# Altium project Single_Hand_YK.PrjPcb
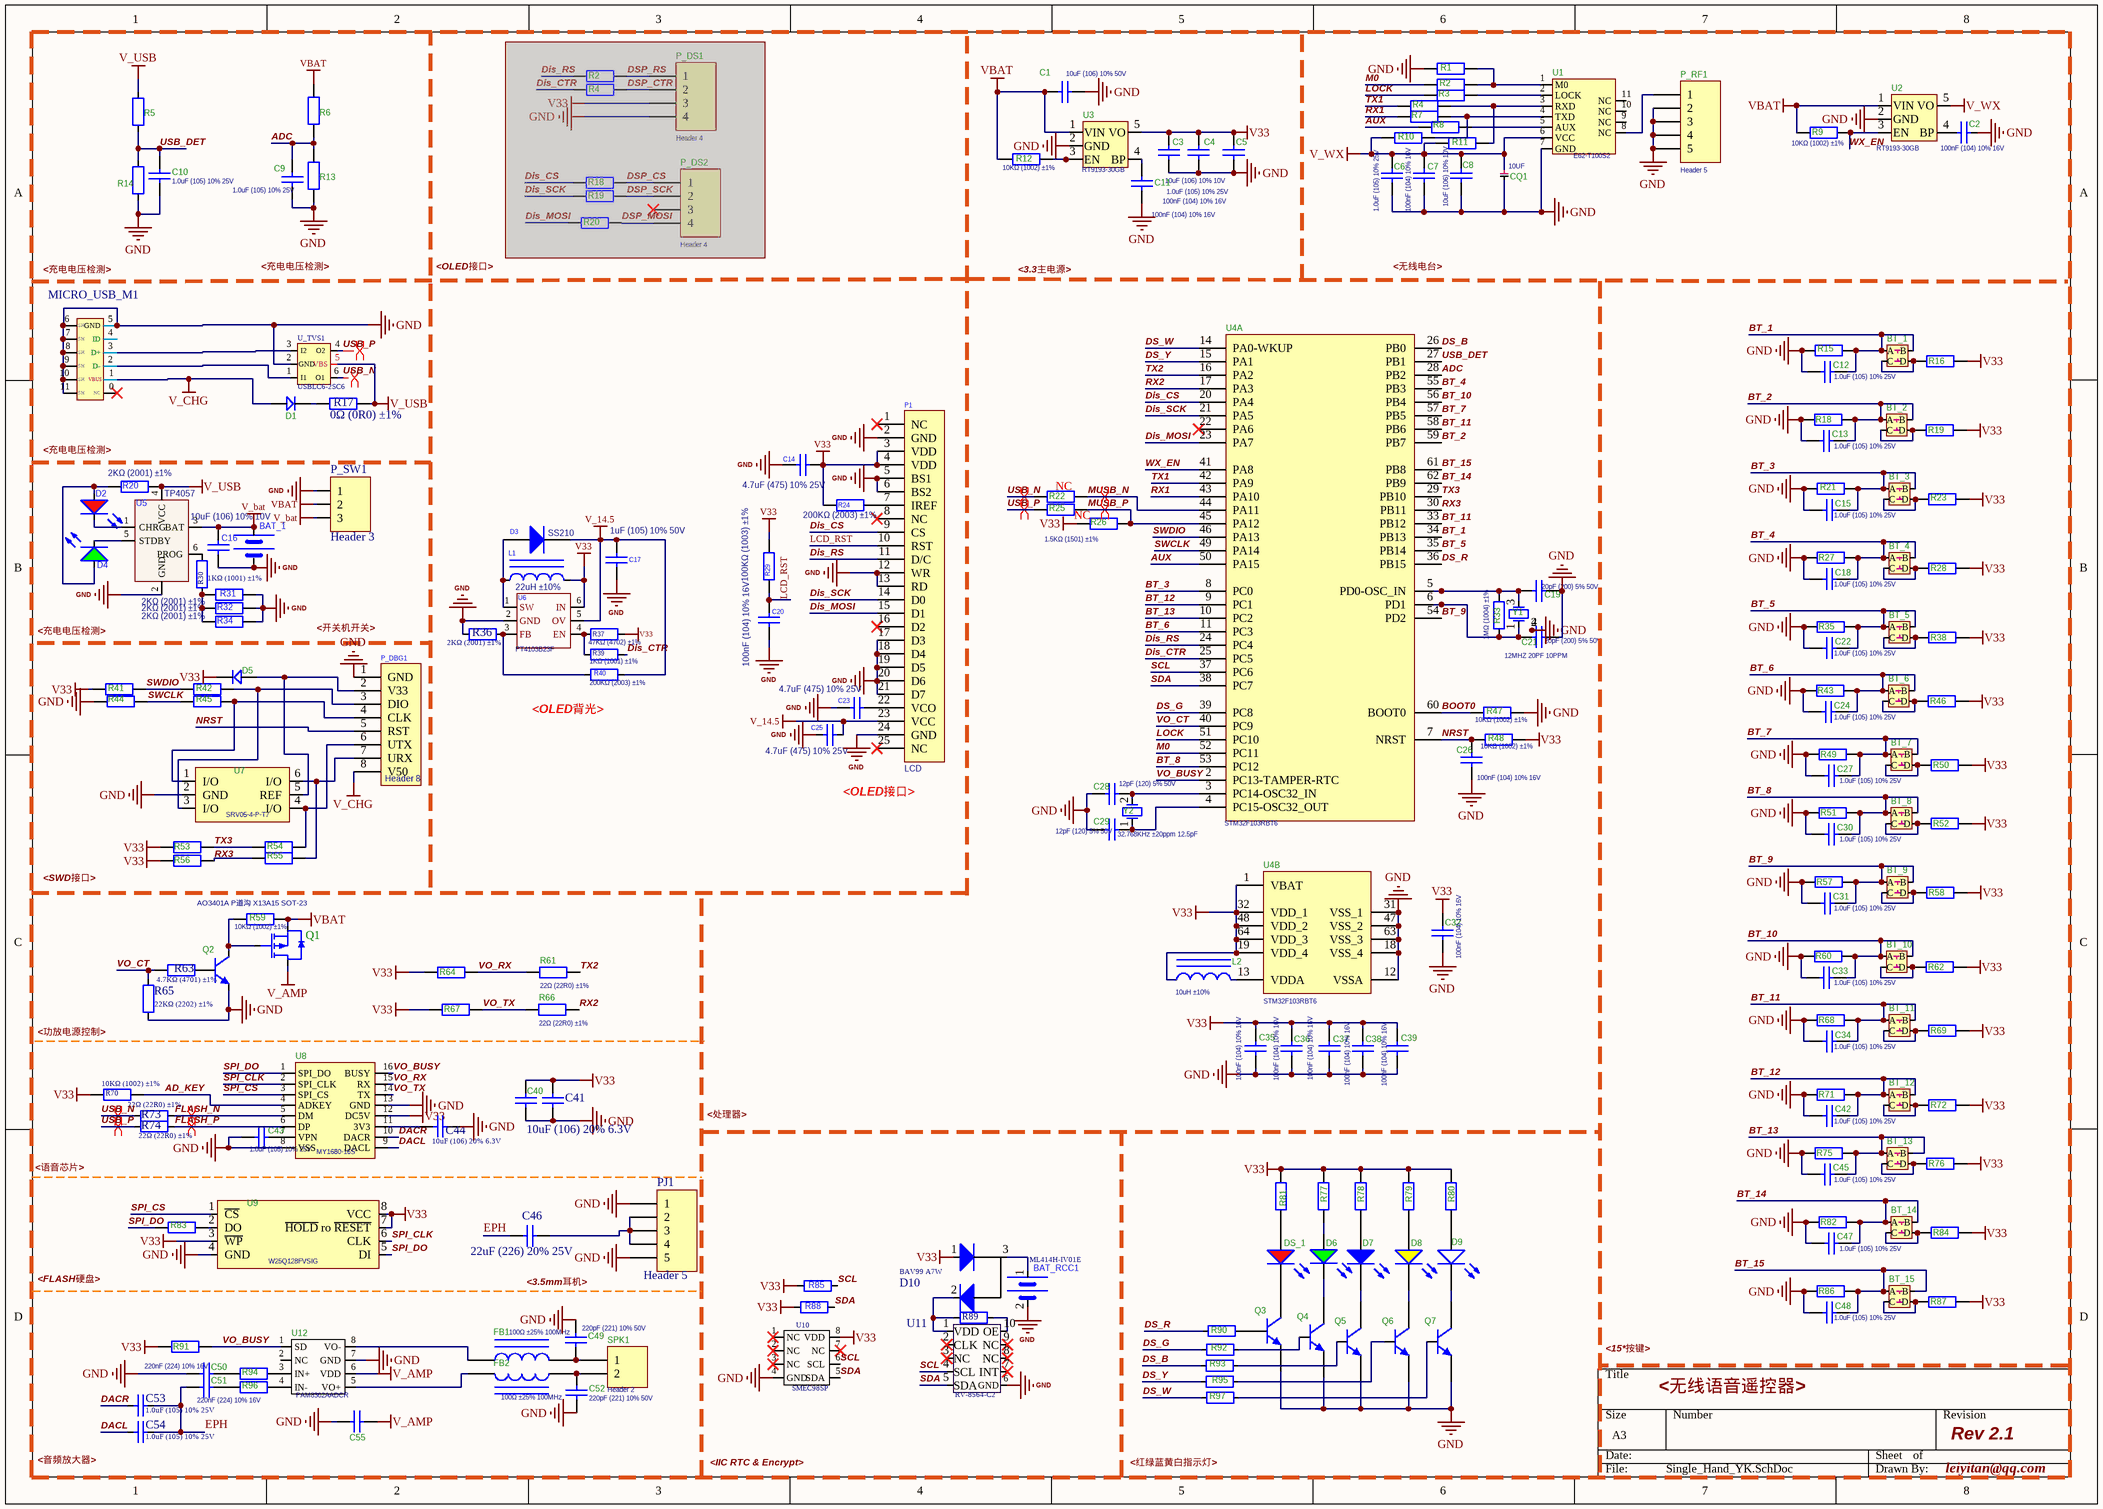
[diagram p0: Single_Hand_YK.SchDoc]
1 sheet, 221 parts. Net scope: global (net labels, ports and power ports of the same name join across sheets).
Board file: Single_Hand_YK.PcbDoc

## Sheet Single_Hand_YK.SchDoc
size A3

### Parts
(Parts that share a designator on the sheet are numbered #1, #2 ... from top to bottom, then left to right.)
BAT_1  CR1120  [HDR1X2]  (value not drawn)
BAT_RCC1  ML414H-IV01E  [ML414H IV01E]
BT_1  BUT_12*12*7.3  [SW-1212]  (value not drawn)
BT_2  BUT_12*12*7.3  [SW-1212]  (value not drawn)
BT_3  BUT_12*12*7.3  [SW-1212]  (value not drawn)
BT_4  BUT_12*12*7.3  [SW-1212]  (value not drawn)
BT_5  BUT_12*12*7.3  [SW-1212]  (value not drawn)
BT_6  BUT_12*12*7.3  [SW-1212]  (value not drawn)
BT_7  BUT_12*12*7.3  [SW-1212]  (value not drawn)
BT_8  BUT_12*12*7.3  [SW-1212]  (value not drawn)
BT_9  BUT_12*12*7.3  [SW-1212]  (value not drawn)
BT_10  BUT_12*12*7.3  [SW-1212]  (value not drawn)
BT_11  BUT_12*12*7.3  [SW-1212]  (value not drawn)
BT_12  BUT_12*12*7.3  [SW-1212]  (value not drawn)
BT_13  BUT_12*12*7.3  [SW-1212]  (value not drawn)
BT_14  BUT_12*12*7.3  [SW-1212]  (value not drawn)
BT_15  BUT_12*12*7.3  [SW-1212]  (value not drawn)
C1  10uF (106) 10% 50V  [1206_C]
C2  100nF (104) 10% 16V  [0402_C]
C3  10uF (106) 10% 10V  [0603_C]
C4  1.0uF (105) 10% 25V  [0402_C]
C5  100nF (104) 10% 16V  [0402_C]
C6  1.0uF (105) 10% 25V  [0402_C]
C7  100nF (104) 10% 16V  [0402_C]
C8  10uF (106) 10% 10V  [0603_C]
C9  1.0uF (105) 10% 25V  [0402_C]
C10  1.0uF (105) 10% 25V  [0402_C]
C11  100nF (104) 10% 16V  [0402_C]
C12  1.0uF (105) 10% 25V  [0402_C]
C13  1.0uF (105) 10% 25V  [0402_C]
C14  4.7uF (475) 10% 25V  [0805_C]
C15  1.0uF (105) 10% 25V  [0402_C]
C16  10uF (106) 10% 10V  [0603_C]
C17  1uF (105) 10% 50V  [0603_C]
C18  1.0uF (105) 10% 25V  [0402_C]
C19  20pF (200) 5% 50V  [0402_C]
C20  100nF (104) 10% 16V  [0402_C]
C21  20pF (200) 5% 50V  [0402_C]
C22  1.0uF (105) 10% 25V  [0402_C]
C23  4.7uF (475) 10% 25V  [0805_C]
C24  1.0uF (105) 10% 25V  [0402_C]
C25  4.7uF (475) 10% 25V  [0805_C]
C26  100nF (104) 10% 16V  [0402_C]
C27  1.0uF (105) 10% 25V  [0402_C]
C28  12pF (120) 5% 50V  [0402_C]
C29  12pF (120) 5% 50V  [0402_C]
C30  1.0uF (105) 10% 25V  [0402_C]
C31  1.0uF (105) 10% 25V  [0402_C]
C32  100nF (104) 10% 16V  [0402_C]
C33  1.0uF (105) 10% 25V  [0402_C]
C34  1.0uF (105) 10% 25V  [0402_C]
C35  100nF (104) 10% 16V  [0402_C]
C36  100nF (104) 10% 16V  [0402_C]
C37  100nF (104) 10% 16V  [0402_C]
C38  100nF (104) 10% 16V  [0402_C]
C39  100nF (104) 10% 16V  [0402_C]
C40  100nF (104) 10% 16V  [0402_C]  (value not drawn)
C41  10uF (106) 20% 6.3V  [0402_C]
C42  1.0uF (105) 10% 25V  [0402_C]
C43  1.0uF (105) 10% 25V  [0402_C]
C44  10uF (106) 20% 6.3V  [0402_C]
C45  1.0uF (105) 10% 25V  [0402_C]
C46  22uF (226) 20% 25V  [0805_C]
C47  1.0uF (105) 10% 25V  [0402_C]
C48  1.0uF (105) 10% 25V  [0402_C]
C49  220pF (221) 10% 50V  [0402_C]
C50  220nF (224) 10% 16V  [0402_C]
C51  220nF (224) 10% 16V  [0402_C]
C52  220pF (221) 10% 50V  [0402_C]
C53  1.0uF (105) 10% 25V  [0402_C]
C54  1.0uF (105) 10% 25V  [0402_C]
C55  10uF (106) 10% 25V  [0805_C]  (value not drawn)
CQ1  10UF  [C1210]
D1  RB160M-60/1A  [M-FLAT]  (value not drawn)
D2  (no value)  [0603_LED_S1]
D3  SS210  [SMA(DO-214AC)_S1]
D4  (no value)  [0603_LED_S1]
D5  CMS01  [M-FLAT]  (value not drawn)
D6  绿灯 0603  [LED-5MM]  (value not drawn)  (no BOM)
D7  蓝灯 0603  [LED-5MM]  (value not drawn)  (no BOM)
D8  黄灯 0603  [LED-5MM]  (value not drawn)  (no BOM)
D9  白灯 0603  [LED-5MM]  (value not drawn)  (no BOM)
D10  BAV99 A7W  [SOT-23(SOT-23-3)]
DS_1  红灯 0603  [LED-5MM]  (value not drawn)  (no BOM)
FB1  100Ω ±25% 100MHz  [0805_L]
FB2  100Ω ±25% 100MHz  [0805_L]
L1  22uH ±10%  [0805_L]
L2  10uH ±10%  [0603_L]
MICRO_USB_M1  沉板MICRO_USB  [MICRO_USB]  (value not drawn)
P1  LCD  [TOEL9M0038]
P_DBG1  Header 8  [MHDR1X8]
P_DS1  Header 4  [MHDR1X4]  (masked out: inside a compile mask, not in the netlist)
P_DS2  Header 4  [MHDR1X4]  (masked out: inside a compile mask, not in the netlist)
P_RF1  Header 5  [SMA-2]
P_SW1  Header 3  [HDR1X3]
PJ1  Header 5  [PJK-381A]
Q1  AO3401A P道沟 X13A15 SOT-23  [SOT-23-3L]
Q2  MMBT5551  G1  [SOT-23(SOT-23-3)]  (value not drawn)
Q3  MMBT5551  G1  [SOT-23(SOT-23-3)]  (value not drawn)
Q4  MMBT5551  G1  [SOT-23(SOT-23-3)]  (value not drawn)
Q5  MMBT5551  G1  [SOT-23(SOT-23-3)]  (value not drawn)
Q6  MMBT5551  G1  [SOT-23(SOT-23-3)]  (value not drawn)
Q7  MMBT5551  G1  [SOT-23(SOT-23-3)]  (value not drawn)
R1  10KΩ (1002) ±1%  [0402_R]  (value not drawn)
R2#1  10Ω (10R0) ±1%  [0402_R]  (value not drawn)  (masked out: inside a compile mask, not in the netlist)
R2#2  22Ω (22R0) ±1%  [0402_R]  (value not drawn)
R3  22Ω (22R0) ±1%  [0402_R]  (value not drawn)
R4#1  10Ω (10R0) ±1%  [0402_R]  (value not drawn)  (masked out: inside a compile mask, not in the netlist)
R4#2  22Ω (22R0) ±1%  [0402_R]  (value not drawn)
R5  100KΩ (1003) ±1%  [0402_R]  (value not drawn)
R6  100KΩ (1003) ±1%  [0402_R]  (value not drawn)
R7  22Ω (22R0) ±1%  [0402_R]  (value not drawn)
R8  22Ω (22R0) ±1%  [0402_R]  (value not drawn)
R9  10KΩ (1002) ±1%  [0402_R]
R10  10KΩ (1002) ±1%  [0402_R]  (value not drawn)
R11  10KΩ (1002) ±1%  [0402_R]  (value not drawn)
R12  10KΩ (1002) ±1%  [0402_R]
R13  100KΩ (1003) ±1%  [0402_R]  (value not drawn)
R14  100KΩ (1003) ±1%  [0402_R]  (value not drawn)
R15  100KΩ (1003) ±1%  [0402_R]  (value not drawn)
R16  10KΩ (1002) ±1%  [0402_R]  (value not drawn)
R17  0Ω (0R0) ±1%  [0603_R]
R18#1  10Ω (10R0) ±1%  [0402_R]  (value not drawn)  (masked out: inside a compile mask, not in the netlist)
R18#2  100KΩ (1003) ±1%  [0402_R]  (value not drawn)
R19#1  10Ω (10R0) ±1%  [0402_R]  (value not drawn)  (masked out: inside a compile mask, not in the netlist)
R19#2  10KΩ (1002) ±1%  [0402_R]  (value not drawn)
R20#1  10Ω (10R0) ±1%  [0402_R]  (value not drawn)  (masked out: inside a compile mask, not in the netlist)
R20#2  2KΩ (2001) ±1%  [0402_R]
R21  100KΩ (1003) ±1%  [0402_R]  (value not drawn)
R22  22Ω (22R0) ±1%  [0402_R]  (value not drawn)  (no BOM)
R23  10KΩ (1002) ±1%  [0402_R]  (value not drawn)
R24  200KΩ (2003) ±1%  [0402_R]
R25  22Ω (22R0) ±1%  [0402_R]  (value not drawn)  (no BOM)
R26  1.5KΩ (1501) ±1%  [0402_R]
R27  100KΩ (1003) ±1%  [0402_R]  (value not drawn)
R28  10KΩ (1002) ±1%  [0402_R]  (value not drawn)
R29  100KΩ (1003) ±1%  [0402_R]
R30  1KΩ (1001) ±1%  [0402_R]
R31  2KΩ (2001) ±1%  [0402_R]
R32  2KΩ (2001) ±1%  [0402_R]
R33  1MΩ (1004) ±1%  [0402_R]
R34  2KΩ (2001) ±1%  [0402_R]
R35  100KΩ (1003) ±1%  [0402_R]  (value not drawn)
R36  2KΩ (2001) ±1%  [0402_R]
R37  47KΩ (4702) ±1%  [0402_R]
R38  10KΩ (1002) ±1%  [0402_R]  (value not drawn)
R39  1KΩ (1001) ±1%  [0402_R]
R40  200KΩ (2003) ±1%  [0402_R]
R41  10KΩ (1002) ±1%  [0402_R]  (value not drawn)
R42  10Ω (10R0) ±1%  [0402_R]  (value not drawn)
R43  100KΩ (1003) ±1%  [0402_R]  (value not drawn)
R44  10KΩ (1002) ±1%  [0402_R]  (value not drawn)
R45  10Ω (10R0) ±1%  [0402_R]  (value not drawn)
R46  10KΩ (1002) ±1%  [0402_R]  (value not drawn)
R47  10KΩ (1002) ±1%  [0402_R]
R48  10KΩ (1002) ±1%  [0402_R]
R49  100KΩ (1003) ±1%  [0402_R]  (value not drawn)
R50  10KΩ (1002) ±1%  [0402_R]  (value not drawn)
R51  100KΩ (1003) ±1%  [0402_R]  (value not drawn)
R52  10KΩ (1002) ±1%  [0402_R]  (value not drawn)
R53  10KΩ (1002) ±1%  [0402_R]  (value not drawn)
R54  22Ω (22R0) ±1%  [0402_R]  (value not drawn)
R55  22Ω (22R0) ±1%  [0402_R]  (value not drawn)
R56  10KΩ (1002) ±1%  [0402_R]  (value not drawn)
R57  100KΩ (1003) ±1%  [0402_R]  (value not drawn)
R58  10KΩ (1002) ±1%  [0402_R]  (value not drawn)
R59  10KΩ (1002) ±1%  [0402_R]
R60  100KΩ (1003) ±1%  [0402_R]  (value not drawn)
R61  22Ω (22R0) ±1%  [0402_R]
R62  10KΩ (1002) ±1%  [0402_R]  (value not drawn)
R63  4.7KΩ (4701) ±1%  [0402_R]
R64  10KΩ (1002) ±1%  [0402_R]  (value not drawn)
R65  22KΩ (2202) ±1%  [0402_R]
R66  22Ω (22R0) ±1%  [0402_R]
R67  10KΩ (1002) ±1%  [0402_R]  (value not drawn)
R68  100KΩ (1003) ±1%  [0402_R]  (value not drawn)
R69  10KΩ (1002) ±1%  [0402_R]  (value not drawn)
R70  10KΩ (1002) ±1%  [0402_R]
R71  100KΩ (1003) ±1%  [0402_R]  (value not drawn)
R72  10KΩ (1002) ±1%  [0402_R]  (value not drawn)
R73  22Ω (22R0) ±1%  [0402_R]
R74  22Ω (22R0) ±1%  [0402_R]
R75  100KΩ (1003) ±1%  [0402_R]  (value not drawn)
R76  10KΩ (1002) ±1%  [0402_R]  (value not drawn)
R77  1KΩ (1001) ±1%  [0402_R]  (value not drawn)
R78  1KΩ (1001) ±1%  [0402_R]  (value not drawn)
R79  1KΩ (1001) ±1%  [0402_R]  (value not drawn)
R80  1KΩ (1001) ±1%  [0402_R]  (value not drawn)
R81  1KΩ (1001) ±1%  [0402_R]  (value not drawn)
R82  100KΩ (1003) ±1%  [0402_R]  (value not drawn)
R83  100Ω (1000) ±1%  [0402_R]  (value not drawn)
R84  10KΩ (1002) ±1%  [0402_R]  (value not drawn)
R85  10KΩ (1002) ±1%  [0402_R]  (value not drawn)
R86  100KΩ (1003) ±1%  [0402_R]  (value not drawn)
R87  10KΩ (1002) ±1%  [0402_R]  (value not drawn)
R88  10KΩ (1002) ±1%  [0402_R]  (value not drawn)
R89  100KΩ (1003) ±1%  [0402_R]  (value not drawn)
R90  10KΩ (1002) ±1%  [0402_R]  (value not drawn)
R91  10KΩ (1002) ±1%  [0402_R]  (value not drawn)
R92  10KΩ (1002) ±1%  [0402_R]  (value not drawn)
R93  10KΩ (1002) ±1%  [0402_R]  (value not drawn)
R94  10KΩ (1002) ±1%  [0402_R]  (value not drawn)
R95  10KΩ (1002) ±1%  [0402_R]  (value not drawn)
R96  10KΩ (1002) ±1%  [0402_R]  (value not drawn)
R97  10KΩ (1002) ±1%  [0402_R]  (value not drawn)
SPK1  Header 2  [HDR1X2]
U1  E62-T100S2  [E62-T100S2]
U2  RT9193-30GB  [SOT-23-5]
U3  RT9193-30GB  [SOT-23-5]
U4  STM32F103RBT6  [LQFP-64_10x10x05P]  (parts A,B of 2)
U5  TP4057  [SOT-23-6]
U6  PT4103B23F  [SOT23-6]
U7  SRV05-4-P-T7  [SOT-23-6]
U8  MY1680-16S  [SOIC-16_150mil]
U9  W25Q128FVSIG  [SOIC-8_208mil]
U10  SMEC98SP  [SOP8]
U11  RV-8564-C2  [RV-8564-C2]
U12  PAM8302AADCR  [SOIC-8_150mil]
U_TVS1  USBLC6-2SC6  [SOT-23-6]
Y1  12MHZ 20PF 10PPM  [SMD-3225_4P]
Y2  32.768KHz ±20ppm 12.5pF  [SMD-3215_2P FC - 135]

### Nets
GND: BAT_1.2(GND) BAT_RCC1.2(GND) C1.2 C2.2 C3.1 C4.1 C5.1 C6.1 C7.1 C8.1 C9.2 C10.2 C11.2 C12.1 C13.1 C14.2 C15.1 C16.1 C17.1 C18.1 C19.2 C20.1 C21.2 C22.1 C23.2 C24.1 C25.2 C26.1 C27.1 C28.1 C29.1 C30.1 C31.1 C32.1 C33.1 C34.1 C35.1 C36.1 C37.1 C38.1 C39.1 C40.1 C41.1 C42.1 C43.1 C44.2 C45.1 C47.1 C48.1 C49.1 C50.1 C52.1 C55.1 CQ1.2 MICRO_USB_M1.5(GND) MICRO_USB_M1.6(SH) MICRO_USB_M1.7(SH) MICRO_USB_M1.8(SH) MICRO_USB_M1.9(SH) MICRO_USB_M1.10(SH) MICRO_USB_M1.11(SH) P1.2(GND) P1.5(BS1) P1.6(BS2) P1.12(WR) P1.13(RD) P1.17(D3) P1.18(D4) P1.19(D5) P1.20(D6) P1.21(D7) P1.24(GND) P_DBG1.1(GND) P_RF1.2 P_RF1.3 P_SW1.1 PJ1.1 PJ1.5 Q2.2(E) Q3.2(E) Q4.2(E) Q5.2(E) Q6.1(B) Q6.2(E) Q7.2(E) R1.2 R13.2 R14.2 R15.1 R18#2.1 R21.1 R27.1 R31.2 R32.2 R34.2 R35.1 R36.1 R43.1 R44.1 R47.2 R49.1 R51.1 R57.1 R60.1 R65.1 R68.1 R71.1 R75.1 R82.1 R86.1 R95.1 U1.7(GND) U2.2(GND) U3.2(GND) U4.12(VSSA) U4.18(VSS_4) U4.31(VSS_1) U4.47(VSS_2) U4.63(VSS_3) U5.2(GND) U6.2(GND) U7.2(GND) U8.8(VSS) U8.13(GND) U9.4(GND) U10.4(GND) U11.6(GND) U12.7(GND) U_TVS1.2(GND) Y1.2(GND) Y1.4(GND)
V33: C3.2 C4.2 C5.2 C14.1 C32.2 C35.2 C36.2 C37.2 C38.2 C39.2 C40.2 C41.2 D5.2 D10.1(A) L1.2 L2.1 P1.3(VDD) P1.4(VDD) R16.2 R19#2.2 R23.2 R24.1 R26.1 R28.2 R29.2 R37.2 R38.2 R41.1 R46.2 R48.2 R50.2 R52.2 R53.1 R56.1 R58.2 R62.2 R64.1 R67.1 R69.2 R70.1 R72.2 R76.2 R77.2 R78.2 R79.2 R80.2 R81.2 R84.2 R85.1 R87.2 R88.1 R91.1 U3.5(VO) U4.1(VBAT) U4.19(VDD_4) U4.32(VDD_1) U4.48(VDD_2) U4.64(VDD_3) U6.6(IN) U8.12(DC5V) U9.3(~{WP}) U9.7(~{HOLD}_ro_~{RESET}) U9.8(VCC) U10.8(VDD)
V_14.5: C17.2 C25.1 D3.2(K) P1.23(VCC) R40.1 U6.5(OV)
V_AMP: C55.2 Q1.3(D) U12.6(VDD)
V_bat: BAT_1.1(VCC) C16.2 P_SW1.3 U5.3(BAT)
V_CHG: D1.1 MICRO_USB_M1.1(VBUS) P_DBG1.8(V50)
V_USB: R5.1 R17.2 R20#2.2 U5.4(VCC) U_TVS1.5(VBS)
V_WX: C6.2 C7.2 C8.2 CQ1.1 R10.1 R11.1 U1.6(VCC) U2.5(VO)
VBAT: C1.1 P_SW1.2 Q1.2(S) R6.1 R9.2 R12.1 R59.2 U2.1(VIN) U3.1(VIN)
AD_KEY: R70.2 U8.4(ADKEY)
ADC: C9.1 R6.2 R13.1 U4.28(PB2)
AUX: R8.1 U4.50(PA15)
BOOT0: R47.1 U4.60(BOOT0)
BT_1: BT_1.1(A) C12.2 R15.2 U4.34(PB13)
BT_2: BT_2.1(A) C13.2 R18#2.2 U4.59(PB7)
BT_3: BT_3.1(A) C15.2 R21.2 U4.8(PC0)
BT_4: BT_4.1(A) C18.2 R27.2 U4.55(PB3)
BT_5: BT_5.1(A) C22.2 R35.2 U4.35(PB14)
BT_6: BT_6.1(A) C24.2 R43.2 U4.11(PC3)
BT_7: BT_7.1(A) C27.2 R49.2 U4.57(PB5)
BT_8: BT_8.1(A) C30.2 R51.2 U4.53(PC12)
BT_9: BT_9.1(A) C31.2 R57.2 U4.54(PD2)
BT_10: BT_10.1(A) C33.2 R60.2 U4.56(PB4)
BT_11: BT_11.1(A) C34.2 R68.2 U4.33(PB12) U4.58(PB6)
BT_12: BT_12.1(A) C42.2 R71.2 U4.9(PC1)
BT_13: BT_13.1(A) C45.2 R75.2 U4.10(PC2)
BT_14: BT_14.1(A) C47.2 R82.2 U4.62(PB9)
BT_15: BT_15.1(A) C48.2 R86.2 U4.61(PB8)
DACL: C54.1 U8.9(DACL)
DACR: C53.1 U8.10(DACR)
Dis_CS: P1.9(CS) U4.20(PA4)
Dis_CTR: R39.2 U4.25(PC5)
Dis_MOSI: P1.15(D1) U4.23(PA7)
Dis_RS: P1.11(D/C) U4.24(PC4)
Dis_SCK: P1.14(D0) U4.21(PA5)
DS_B: R93.2 U4.26(PB0)
DS_G: R92.2 U4.39(PC8)
DS_R: R90.2 U4.36(PB15)
DS_W: R97.2 U4.14(PA0-WKUP)
DS_Y: R95.2 U4.15(PA1)
EPH: C46.1 C51.2 C53.2 C54.2
FLASH_N: R73.2 U8.5(DM)
FLASH_P: R74.2 U8.6(DP)
LCD_RST: C20.2 P1.10(RST) R29.1
LOCK: R3.1 U4.51(PC10)
M0: R2#2.1 U4.52(PC11)
MUSB_N: R22.1 U4.44(PA11)
MUSB_P: R25.1 R26.2 U4.45(PA12)
NRST: C26.2 P_DBG1.5(RST) R48.1 U4.7(NRST)
RX1: R7.1 U4.43(PA10)
RX2: R66.2 U4.17(PA3)
RX3: R55.1 R56.2 U4.30(PB11)
SCL: R85.2 U4.37(PC6) U10.6(SCL) U11.4(SCL)
SDA: R88.2 U4.38(PC7) U10.5(SDA) U11.5(SDA)
SPI_CLK: U8.2(SPI_CLK) U9.6(CLK)
SPI_CS: U8.3(SPI_CS) U9.1(~{CS})
SPI_DO: R83.1 U8.1(SPI_DO) U9.5(DI)
SWCLK: R44.2 R45.1 U4.49(PA14)
SWDIO: R41.2 R42.1 U4.46(PA13)
TX1: R4#2.1 U4.42(PA9)
TX2: R61.2 U4.16(PA2)
TX3: R53.2 R54.1 U4.29(PB10)
USB_DET: C10.1 R5.2 R14.1 U4.27(PB1)
USB_N: R22.2 R73.1 U_TVS1.6(O1)
USB_P: R25.2 R74.1 U_TVS1.4(O2)
VO_BUSY: R91.2 U4.2(PC13-TAMPER-RTC) U8.16(BUSY) U12.1(SD)
VO_CT: R63.1 R65.2 U4.40(PC9)
VO_RX: R61.1 R64.2 U8.15(RX)
VO_TX: R66.1 R67.2 U8.14(TX)
WX_EN: R9.1 U2.3(EN) U4.41(PA8)
NetBAT_RCC1_1: BAT_RCC1.1(VCC) D10.3(K)
NetBT_1_2: BT_1.2(D) R16.1
NetBT_2_2: BT_2.2(D) R19#2.1
NetBT_3_2: BT_3.2(D) R23.1
NetBT_4_2: BT_4.2(D) R28.1
NetBT_5_2: BT_5.2(D) R38.1
NetBT_6_2: BT_6.2(D) R46.1
NetBT_7_2: BT_7.2(D) R50.1
NetBT_8_2: BT_8.2(D) R52.1
NetBT_9_2: BT_9.2(D) R58.1
NetBT_10_2: BT_10.2(D) R62.1
NetBT_11_2: BT_11.2(D) R69.1
NetBT_12_2: BT_12.2(D) R72.1
NetBT_13_2: BT_13.2(D) R76.1
NetBT_14_2: BT_14.2(D) R84.1
NetBT_15_2: BT_15.2(D) R87.1
NetC2_1: C2.1 U2.4(BP)
NetC11_1: C11.1 U3.4(BP)
NetC19_1: C19.1 R33.2 U4.5(PD0-OSC_IN) Y1.3(OSC2)
NetC21_1: C21.1 R33.1 U4.6(PD1) Y1.1(OSC1)
NetC23_1: C23.1 P1.22(VCO)
NetC28_2: C28.2 U4.3(PC14-OSC32_IN) Y2.2(OSC2)
NetC29_2: C29.2 U4.4(PC15-OSC32_OUT) Y2.1(OSC1)
NetC43_2: C43.2 U8.7(VPN)
NetC44_1: C44.1 U8.11(3V3)
NetC46_2: C46.2 PJ1.2 PJ1.3 PJ1.4
NetC49_2: C49.2 FB1.2 SPK1.1
NetC50_2: C50.2 R94.1
NetC51_1: C51.1 R96.1
NetC52_2: C52.2 FB2.1 SPK1.2
NetD1_2: D1.2 R17.1
NetD2_A: D2.A D4.A R20#2.1
NetD2_K: D2.K U5.1(CHRG)
NetD3_1: D3.1(A) L1.1 U6.1(SW)
NetD4_K: D4.K U5.5(STDBY)
NetD5_1: D5.1 P_DBG1.2(V33) U7.5(REF)
NetD6_1: D6.1(A) R77.1
NetD6_2: D6.2(K) Q4.3(C)
NetD7_1: D7.1(A) R78.1
NetD7_2: D7.2(K) Q5.3(C)
NetD8_1: D8.1(A) R79.1
NetD8_2: D8.2(K) Q6.3(C)
NetD9_1: D9.1(A) R80.1
NetD9_2: D9.2(K) Q7.3(C)
NetD10_2: D10.2(A) R89.1 U11.1(VDD)
NetDS_1_1: DS_1.1(A) R81.1
NetDS_1_2: DS_1.2(K) Q3.3(C)
NetFB1_1: FB1.1 U12.8(VO-)
NetFB2_2: FB2.2 U12.5(VO+)
NetL2_2: L2.2 U4.13(VDDA)
NetMICRO_USB_M1_2: MICRO_USB_M1.2(D-) U_TVS1.1(I1)
NetMICRO_USB_M1_3: MICRO_USB_M1.3(D+) U_TVS1.3(I2)
NetP1_7: P1.7(IREF) R24.2
NetP_DBG1_3: P_DBG1.3(DIO) R42.2 U7.3(I/O)
NetP_DBG1_4: P_DBG1.4(CLK) R45.2 U7.1(I/O)
NetP_DBG1_6: P_DBG1.6(UTX) R54.2 U7.4(I/O)
NetP_DBG1_7: P_DBG1.7(URX) R55.2 U7.6(I/O)
NetP_RF1_1: P_RF1.1 U1.8(NC)
NetQ1_1: Q1.1(G) Q2.3(C) R59.1
NetQ2_1: Q2.1(B) R63.2
NetQ3_1: Q3.1(B) R90.1
NetQ4_1: Q4.1(B) R92.1
NetQ5_1: Q5.1(B) R93.1
NetQ7_1: Q7.1(B) R97.1
NetR1_1: R1.1 R2#2.2 U1.1(M0)
NetR3_2: R3.2 U1.2(LOCK)
NetR4#2_2: R4#2.2 R11.2 U1.3(RXD)
NetR7_2: R7.2 R10.2 U1.4(TXD)
NetR8_2: R8.2 U1.5(AUX)
NetR12_2: R12.2 U3.3(EN)
NetR30_1: R30.1 R31.1 R32.1 R34.1
NetR30_2: R30.2 U5.6(PROG)
NetR36_2: R36.2 R40.2 U6.3(FB)
NetR37_1: R37.1 R39.1 U6.4(EN)
NetR83_2: R83.2 U9.2(DO)
NetR89_2: R89.2 U11.10(OE)
NetR94_2: R94.2 U12.3(IN+)
NetR96_2: R96.2 U12.4(IN-)

Not connected (* = marked no-connect by the designer): MICRO_USB_M1 0(NC)* 4(ID); P1 1(NC)* 8(NC)* 16(D2)* 25(NC)*; U1 9(NC) 10(NC) 11(NC); U4 22(PA6)*; U10 1(NC)* 2(NC)* 3(NC)* 7(NC)*; U11 2(CLK)* 3(NC)* 7(INT)* 8(NC)* 9(NC)*; U12 2(NC)

### Layout directives
differential pair: FLASH_N, FLASH_P, MUSB_N, MUSB_P, USB_N, USB_P

### Notes on the sheet
- (near MICRO_USB_M1) <充电电压检测>
- <充电电压检测>
- <OLED接口>
- <3.3主电源>
- <无线电台>
- (near R22) NC
- (near R25) NC
- <开关机开关>
- <OLED背光>
- <SWD接口>
- <功放电源控制>
- <处理器>
- <语音芯片>
- <FLASH硬盘>
- <3.5mm耳机>
- <15*按键>
- <无线语音遥控器>
- <音频放大器>
- <IIC RTC & Encrypt>
- <红绿蓝黄白指示灯>
- Rev 2.1
- leiyitan@qq.com

### Library data of the parts
BAT_1 = BAT
BAT_RCC1 = BAT: ML414H-IV01E  3.3V 0.07F
C1 = 1206 10uF (106) 10% 50V: 贴片电容; ComponentLink1URL: http://www.szlcsc.com/product/details_14236.html; Package: 1206; Supplier: LC; SuppliersPartNumber: C13585
C2 C5 C7 C11 C20 C26 C32 C35-C40 = 0402 100nF (104) 10% 16V: 贴片电容; ComponentLink1URL: http://www.szlcsc.com/product/details_1877.html; Package: 0402; Supplier: LC; SuppliersPartNumber: C1525
  C20: ComponentLink1Description: 供应商链接
C3 C8 C16 = 0603 10uF (106) 10% 10V: 贴片电容; ComponentLink1URL: http://www.szlcsc.com/product/details_20411.html; Package: 0603; Supplier: LC; SuppliersPartNumber: C19702
  C16: ComponentLink1Description: 供应商链接
C4 C6 C9 C10 C12 C13 C15 C18 C22 C24 C27 C30 C31 C33 C34 C42 C43 C45 C47 C48 C53 C54 = 0402 1.0uF (105) 10% 25V: 贴片电容; ComponentLink1URL: http://www.szlcsc.com/product/details_53938.html; Package: 0402; Supplier: LC; SuppliersPartNumber: C52923
  C53 C54: ComponentLink1Description: 供应商链接
C14 C23 C25 = 0805 4.7uF (475) 10% 25V: 贴片电容; ComponentLink1Description: 供应商链接; ComponentLink1URL: http://www.szlcsc.com/product/details_2131.html; Package: 0805; Supplier: LC; SuppliersPartNumber: C1779
C17 = 0603 1uF (105) 10% 50V: 贴片电容; ComponentLink1Description: 供应商链接; ComponentLink1URL: http://www.szlcsc.com/product/details_16531.html; Package: 0603; Supplier: LC; SuppliersPartNumber: C15849
C19 C21 = 0402 20pF (200) 5% 50V: 贴片电容; ComponentLink1URL: http://www.szlcsc.com/product/details_1906.html; Package: 0402; Supplier: LC; SuppliersPartNumber: C1554
C28 C29 = 0402 12pF (120) 5% 50V: 贴片电容; ComponentLink1URL: http://www.szlcsc.com/product/details_1899.html; Package: 0402; Supplier: LC; SuppliersPartNumber: C1547
C41 C44 = 0402 10uF (106) 20% 6.3V: 贴片电容; ComponentLink1Description: 供应商链接; ComponentLink1URL: http://www.szlcsc.com/product/details_16204.html; Package: 0402; Supplier: LC; SuppliersPartNumber: C15525
C46 = 0805 22uF (226) 20% 25V: 贴片电容; ComponentLink1Description: 供应商链接; ComponentLink1URL: http://www.szlcsc.com/product/details_46786.html; Package: 0805; Supplier: LC; SuppliersPartNumber: C45783
C49 C52 = 0402 220pF (221) 10% 50V: 贴片电容; ComponentLink1URL: http://www.szlcsc.com/product/details_1882.html; Package: 0402; Supplier: LC; SuppliersPartNumber: C1530
C50 C51 = 0402 220nF (224) 10% 16V: 贴片电容; ComponentLink1URL: http://www.szlcsc.com/product/details_17456.html; Package: 0402; Supplier: LC; SuppliersPartNumber: C16772
C55 = 0805 10uF (106) 10% 25V: 贴片电容; ComponentLink1URL: http://www.szlcsc.com/product/details_16532.html; Package: 0805; Supplier: LC; SuppliersPartNumber: C15850
CQ1 = C: 贴片电容; VAL: 贴片电容10UF 100V 1210 106K 10% X7R 无极性电容10UF C3225陶瓷; Package: C1210
D1 D5 = D: 二极管
D2 DS_1 = 0603 红灯: 发光二极管; ComponentLink1URL: http://www.szlcsc.com/product/details_2659.html; Package: 0603; Supplier: LC; SuppliersPartNumber: C2286
  D2: ComponentLink1Description: 供应商链接
D3 = SMA(DO-214AC) SS210: 二极管; ComponentLink1Description: 供应商链接; ComponentLink1URL: http://www.szlcsc.com/product/details_15669.html; Package: SMA(DO-214AC); Supplier: LC; SuppliersPartNumber: C14996
D4 D6 = 0603 绿灯: 发光二极管; ComponentLink1URL: http://www.szlcsc.com/product/details_73152.html; Package: 0603; Supplier: LC; SuppliersPartNumber: C72043
  D4: ComponentLink1Description: 供应商链接
D7 = 0603 蓝灯: 发光二极管; ComponentLink1URL: http://www.szlcsc.com/product/details_73150.html; Package: 0603; Supplier: LC; SuppliersPartNumber: C72041
D8 = 0603 黄灯: 发光二极管; ComponentLink1URL: http://www.szlcsc.com/product/details_73147.html; Package: 0603; Supplier: LC; SuppliersPartNumber: C72038
D9 = 0603 白灯: 发光二极管; ComponentLink1URL: http://www.szlcsc.com/product/details_2663.html; Package: 0603; Supplier: LC; SuppliersPartNumber: C2290
D10 = SOT-23 BAV99 A7W: 开关二极管; ComponentLink1Description: 供应商链接; ComponentLink1URL: http://www.szlcsc.com/product/details_2877.html; Package: SOT-23; Supplier: LC; SuppliersPartNumber: C2500
FB1 FB2 = 0805 100Ω 25% 100MHz: 贴片磁珠; ComponentLink1URL: http://www.szlcsc.com/product/details_1367.html; Package: 0805; Supplier: LC; SuppliersPartNumber: C1015
L1 = 0805 22uH 10%: 贴片电感; ComponentLink1Description: 供应商链接; ComponentLink1URL: http://www.szlcsc.com/product/details_33340.html; Package: 0805; Supplier: LC; SuppliersPartNumber: C32375
L2 = 0603 10uH 10%: 贴片电感; ComponentLink1URL: http://www.szlcsc.com/product/details_1387.html; Package: 0603; Supplier: LC; SuppliersPartNumber: C1035
MICRO_USB_M1 = MICRO_USB_M2: 小米2尾插; 链接: https://item.taobao.com/item.htm?spm=a1z09.2.0.0.d16f2e8dajnK9S&id=564757951180&_u=u102dhvu3d27
P1 = Header 25: Header, 25-Pin
P_DBG1 = Header 8: Header, 8-Pin
P_DS1 P_DS2 = Header 4: Header, 4-Pin
P_RF1 PJ1 = Header 5: Header, 5-Pin
  PJ1: LatestRevisionDate: 17-Jul-2002; LatestRevisionNote: Re-released for DXP Platform.; Publisher: Altium Limited
P_SW1 = Header 3: Header, 3-Pin; LatestRevisionDate: 17-Jul-2002; LatestRevisionNote: Re-released for DXP Platform.; Publisher: Altium Limited
Q1 = AO3401A P道沟 X13A15 SOT-23: MOS(场效应管); ComponentLink1Description: 供应商链接; ComponentLink1URL: http://www.szlcsc.com/product/details_15801.html; Package: SOT-23; Supplier: LC; SuppliersPartNumber: C15127
Q2-Q7 = SOT-23 MMBT5551  G1: 三极管; ComponentLink1URL: http://www.szlcsc.com/product/details_2502.html; Package: SOT-23; Supplier: LC; SuppliersPartNumber: C2145
R1 R5 R6 R9-R14 R16 R19#2 R23 R28 R38 R41 R44 R46-R48 R50 R52 R53 R56 R58 R59 R62 R64 R67 R69 R70 R72 R76 R84 R85 R87 R88 R90-R97 = 0402 10KΩ (1002) 1%: 贴片电阻; Package: 0402; Supplier: LC
  R1 R9-R12 R16 R19#2 R23 R28 R38 R41 R44 R46-R48 R50 R52 R53 R56 R58 R59 R62 R64 R67 R69 R72 R76 R84 R87 R90-R97: ComponentLink1URL: http://www.szlcsc.com/product/details_26487.html; SuppliersPartNumber: C25744
  R5 R6 R13 R14: ComponentLink1URL: http://www.szlcsc.com/product/details_26484.html; SuppliersPartNumber: C25741
  R70 R85 R88: ComponentLink1Description: 供应商链接; ComponentLink1URL: http://www.szlcsc.com/product/details_26487.html; SuppliersPartNumber: C25744
R2#1 R4#1 R18#1 R19#1 R20#1 R42 R45 = 0402 10Ω (10R0) 1%: 贴片电阻; ComponentLink1URL: http://www.szlcsc.com/product/details_25820.html; Package: 0402; Supplier: LC; SuppliersPartNumber: C25077
R2#2 R3 R4#2 R7 R8 R22 R25 R54 R55 R61 R66 R73 R74 = 0402 22Ω (22R0) 1%: 贴片电阻; ComponentLink1URL: http://www.szlcsc.com/product/details_25835.html; Package: 0402; Supplier: LC; SuppliersPartNumber: C25092
  R73 R74: ComponentLink1Description: 供应商链接
R15 R18#2 R21 R27 R29 R35 R43 R49 R51 R57 R60 R68 R71 R75 R82 R86 R89 = 0402 100KΩ (1003) 1%: 贴片电阻; ComponentLink1URL: http://www.szlcsc.com/product/details_26484.html; Package: 0402; Supplier: LC; SuppliersPartNumber: C25741
  R29 R89: ComponentLink1Description: 供应商链接
R17 = 0603 0Ω (0R0) 1%: 贴片电阻; ComponentLink1Description: 供应商链接; ComponentLink1URL: http://www.szlcsc.com/product/details_21903.html; Package: 0603; Supplier: LC; SuppliersPartNumber: C21189
R20#2 R31 R32 R34 R36 = 0402 2KΩ (2001) 1%: 贴片电阻; ComponentLink1Description: 供应商链接; ComponentLink1URL: http://www.szlcsc.com/product/details_4516.html; Package: 0402; Supplier: LC; SuppliersPartNumber: C4109
R24 R40 = 0402 200KΩ (2003) 1%: 贴片电阻; ComponentLink1Description: 供应商链接; ComponentLink1URL: http://www.szlcsc.com/product/details_26507.html; Package: 0402; Supplier: LC; SuppliersPartNumber: C25764
R26 = 0402 1.5KΩ (1501) 1%: 贴片电阻; ComponentLink1URL: http://www.szlcsc.com/product/details_26610.html; Package: 0402; Supplier: LC; SuppliersPartNumber: C25867
R30 R39 R77-R81 = 0402 1KΩ (1001) 1%: 贴片电阻; ComponentLink1URL: http://www.szlcsc.com/product/details_12256.html; Package: 0402; Supplier: LC; SuppliersPartNumber: C11702
  R30 R39: ComponentLink1Description: 供应商链接
R33 = 0402 1MΩ (1004) 1%: 贴片电阻; ComponentLink1URL: http://www.szlcsc.com/product/details_26826.html; Package: 0402; Supplier: LC; SuppliersPartNumber: C26083
R37 = 0402 47KΩ (4702) 1%: 贴片电阻; ComponentLink1Description: 供应商链接; ComponentLink1URL: http://www.szlcsc.com/product/details_26535.html; Package: 0402; Supplier: LC; SuppliersPartNumber: C25792
R63 = 0402 4.7KΩ (4701) 1%: 贴片电阻; ComponentLink1Description: 供应商链接; ComponentLink1URL: http://www.szlcsc.com/product/details_26643.html; Package: 0402; Supplier: LC; SuppliersPartNumber: C25900
R65 = 0402 22KΩ (2202) 1%: 贴片电阻; ComponentLink1Description: 供应商链接; ComponentLink1URL: http://www.szlcsc.com/product/details_26511.html; Package: 0402; Supplier: LC; SuppliersPartNumber: C25768
R83 = 0402 100Ω (1000) 1%: 贴片电阻; ComponentLink1URL: http://www.szlcsc.com/product/details_25819.html; Package: 0402; Supplier: LC; SuppliersPartNumber: C25076
SPK1 = Header 2: Header, 2-Pin
U1 = E62-T100S2: 433M无线模块
U2 U3 = RT9193-33GB: 低压差线性稳压(LDO); SuppliersPartNumber: C50004; Package: SOT-23-5; ComponentLink1URL: http://www.szlcsc.com/product/details_51013.html
U4 = STM32F103RBT6: ARM; ComponentLink1URL: http://www.szlcsc.com/product/details_9244.html; Package: LQFP-64_10x10x05P; Supplier: LC; SuppliersPartNumber: C8735
U5 = TP4057: 电池电源管理芯片; ComponentLink1URL: http://item.szlcsc.com/12599.html; Package: SOT-23-6; SuppliersPartNumber: C12044; ComponentLink1Description: 供应商链接
U6 = PT4103: LED驱动; ComponentLink1URL: http://item.szlcsc.com/20570.html; Package: SOT-23-6; SuppliersPartNumber: C19861; ComponentLink1Description: 供应商链接
U7 = SRV05-4-P-T7: TVS; ComponentLink1URL: http://www.szlcsc.com/product/details_86537.html; Package: SOT-23-6; Supplier: LC; SuppliersPartNumber: C85364
U8 = MY1680-16S: 音频IC
U9 = W25Q128FVSIG: Flash ROM; ComponentLink1URL: http://www.szlcsc.com/product/details_36072.html; Package: SOIC-8; Supplier: LC; SuppliersPartNumber: C35101
U10 = SMEC98SP: 防抄板加密芯片SMEC98SP; ComponentLink1URL: https://item.taobao.com/item.htm?spm=a1z10.3-c.w4002-15088534153.13.540b588a2BCacW&id=542824980770; ComponentLink1Description: 供应商链接
U11 = RCV-8564-C2: RTC时钟IC; ComponentLink1URL: https://item.taobao.com/item.htm?spm=a1z09.2.0.0.37342e8dj7yxy8&id=42171082284&_u=2102dhvu65a5; ComponentLink1Description: 供应商链接
U12 = PAM8302AADCR: 音频放大器
U_TVS1 = USBLC6-2SC6: ESD二极管; ComponentLink1URL: http://item.szlcsc.com/7996.html; SuppliersPartNumber: C7519; Package: SOT-23-6; ComponentLink1Description: 供应商链接
Y1 = SMD-3225_4P  12MHZ 20PF 10PPM: 贴片晶振; ComponentLink1URL: http://www.szlcsc.com/product/details_9522.html; Package: SMD-3225_4P; Supplier: LC; SuppliersPartNumber: C9002
Y2 = SMD-3215_2P 32.768KHz 20ppm 12.5pF: 贴片晶振; ComponentLink1URL: http://www.szlcsc.com/product/details_33310.html; Package: SMD-3215_2P; Supplier: LC; SuppliersPartNumber: C32346